# Altium schematic sheet LCD.SchDoc
size A
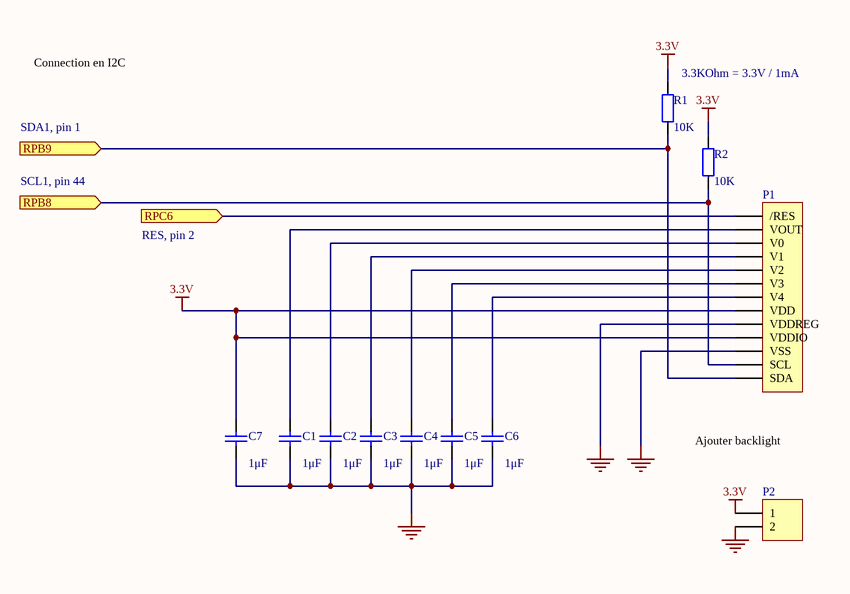
[diagram p0: LCD.SchDoc]

## Parts
C1  value 1μF  [0603]  (hidden comment: Cap)
C2  value 1μF  [0603]  (hidden comment: Cap)
C3  value 1μF  [0603]  (hidden comment: Cap)
C4  value 1μF  [0603]  (hidden comment: Cap)
C5  value 1μF  [0603]  (hidden comment: Cap)
C6  value 1μF  [0603]  (hidden comment: Cap)
C7  value 1μF  [0603]  (hidden comment: Cap)
P1  LCD  [lcd]  (value not drawn)
P2  lcd backlight  [lcd bk]  (value not drawn)
R1  value 10K  [0603]  (hidden comment: Res2)
R2  value 10K  [0603]  (hidden comment: Res2)

## Ports
RPB8 (in), RPB9 (in), RPC6 (in)

## Nets
3.3V: C7.2 P1.8(VDD) P1.10(VDDIO) P2.1 R1.2 R2.2
GND: C1.1 C2.1 C3.1 C4.1 C5.1 C6.1 C7.1 P1.9(VDDREG) P1.11(VSS) P2.2
RPB8: P1.12(SCL) R2.1 ; port RPB8
RPB9: P1.13(SDA) R1.1 ; port RPB9
RPC6: P1.1(/RES) ; port RPC6
NetC1_2: C1.2 P1.2(VOUT)
NetC2_2: C2.2 P1.3(V0)
NetC3_2: C3.2 P1.4(V1)
NetC4_2: C4.2 P1.5(V2)
NetC5_2: C5.2 P1.6(V3)
NetC6_2: C6.2 P1.7(V4)

## Notes on the sheet
- Connection en I2C
- (near R1) 3.3KOhm = 3.3V / 1mA
- SDA1, pin 1
- SCL1, pin 44
- RES, pin 2
- (near P2) Ajouter backlight

## Library data of the parts
C1-C7 = Cap: Capacitor; Published: 8-Jun-2000; LatestRevisionDate: 17-Jul-2002; LatestRevisionNote: Re-released for DXP Platform.; PackageReference: RAD-0.3; Publisher: Altium Limited; PackageDescription: Radial Cap, Thru-Hole; 2 Leads; 0.3 in Pin Spacing
P1 = Header 13: LCD Connector; REF FABRIQUANT: MCCOG42005A6W-BNMLWI; FABRIQUANT: MIDAS; FOURNISSEUR: FARNELL; REF FOURNISSEUR: 2218946; LatestRevisionDate: 17-Jul-2002; LatestRevisionNote: Re-released for DXP Platform.; Publisher: Altium Limited
P2 = Header 2H: Header, 2-Pin, Right Angle; FOURNISSEUR: Farnell; FABRIQUANT: PHOENIX CONTACT; REF FABRIQUANT: 1725656; REF FOURNISSEUR: 3041359
R1 R2 = Res2: Resistor; Published: 8-Jun-2000; LatestRevisionDate: 17-Jul-2002; LatestRevisionNote: Re-released for DXP Platform.; PackageReference: AXIAL-0.4; Publisher: Altium Limited; PackageDescription: Axial Device, Thru-Hole; 2 Leads; 0.4 in Pin Spacing